# EAGLE design Qwiic_TCA9534 (EAGLE 7.7.0)
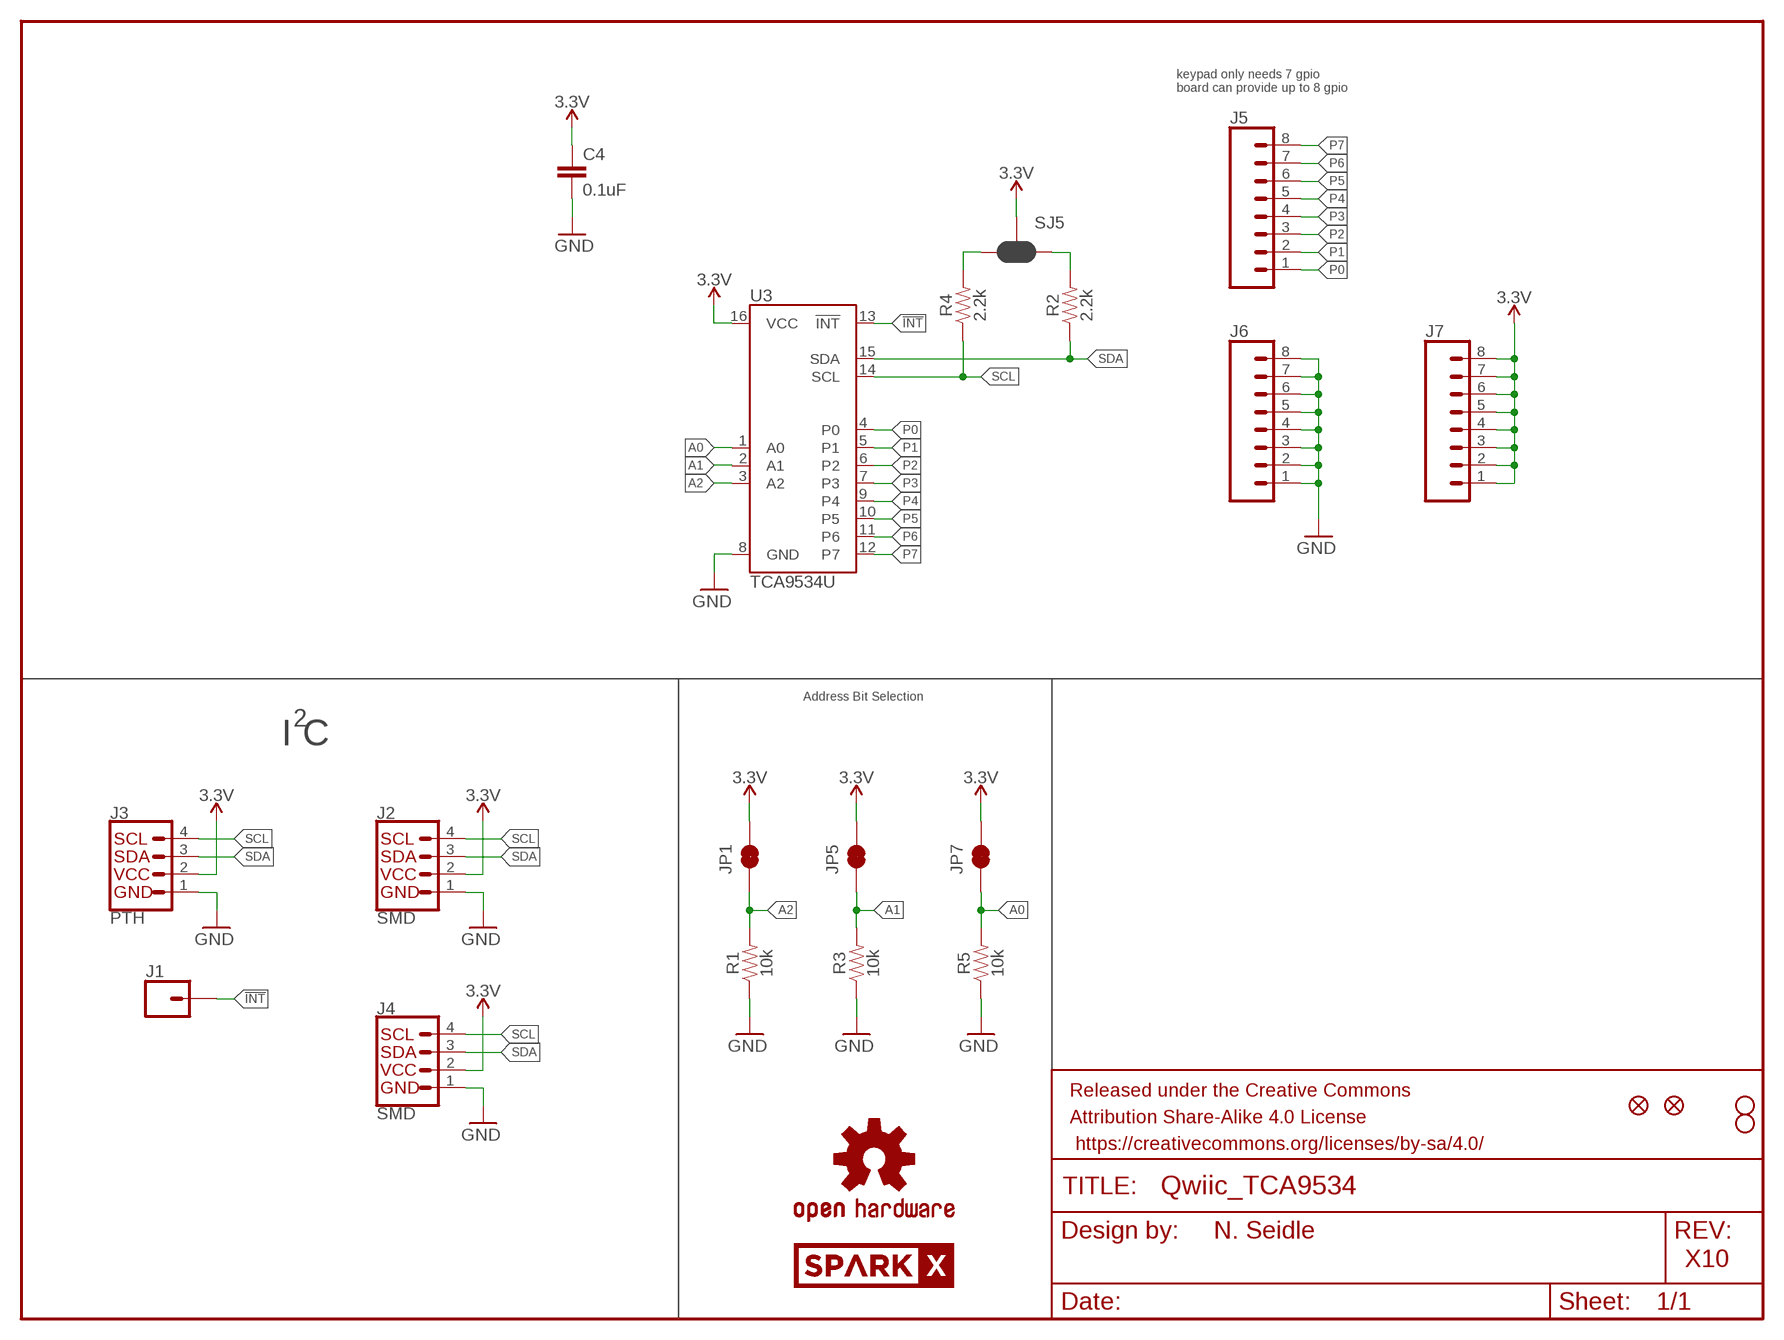
[diagram p0: schematic, sheet 1]

## Parts
C4  0.1uF  0.1UF-0603-25V-(+80/-20%)  [0603]
FRAME1  FRAME-LETTER  [CREATIVE_COMMONS]
J1  CONN_01PTH_NO_SILK_YES_STOP  [1X01_NO_SILK]
J2  SMD  I2C_STANDARDJS-1MM  [1X04_1MM_RA]
J3  PTH  I2C_STANDARD_NO_SILK  [1X04_NO_SILK]
J4  SMD  I2C_STANDARDJS-1MM  [1X04_1MM_RA]
J5  CONN_08NO_SILK_FEMALE_PTH  [1X08_NO_SILK]
J6  CONN_08NO_SILK_FEMALE_PTH  [1X08_NO_SILK]
J7  CONN_08NO_SILK_FEMALE_PTH  [1X08_NO_SILK]
JP1  JUMPER-SMT_2_NC_TRACE_NO-SILK  [SMT-JUMPER_2_NC_TRACE_NO-SILK]
JP2  FIDUCIALUFIDUCIAL  [MICRO-FIDUCIAL]
JP3  STAND-OFF  [STAND-OFF]
JP4  STAND-OFF  [STAND-OFF]
JP5  JUMPER-SMT_2_NC_TRACE_NO-SILK  [SMT-JUMPER_2_NC_TRACE_NO-SILK]
JP6  FIDUCIALUFIDUCIAL  [MICRO-FIDUCIAL]
JP7  JUMPER-SMT_2_NC_TRACE_NO-SILK  [SMT-JUMPER_2_NC_TRACE_NO-SILK]
LOGO1  OSHW-LOGOMINI  [OSHW-LOGO-MINI]
R1  10k  2.2KOHM-0603-1/10W-1%  [0603]
R2  2.2k  2.2KOHM-0603-1/10W-1%  [0603]
R3  10k  2.2KOHM-0603-1/10W-1%  [0603]
R4  2.2k  2.2KOHM-0603-1/10W-1%  [0603]
R5  10k  2.2KOHM-0603-1/10W-1%  [0603]
SJ5  SMT-JUMPER-_3-2-NC-PASTE_TALL  [SMT-JUMPER_3-2-NC-PASTE_SILK_TALLER_A]
U3  TCA9534U  [16SOIC]
U$1  SPARKX-LOGO3  [SPARKX-SMALL]
U$2  SPARKX-LOGO3  [SPARKX-SMALL]

## Nets
3.3V: C4.1 J2.2(VCC) J3.2(VCC) J4.2(VCC) J7.1 J7.2 J7.3 J7.4 J7.5 J7.6 J7.7 J7.8 JP1.2 JP5.2 JP7.2 SJ5.2 U3.16(VCC)
!INT: J1.1 U3.13(!INT)
A0: JP7.1 R5.2 U3.1(A0)
A1: JP5.1 R3.2 U3.2(A1)
A2: JP1.1 R1.2 U3.3(A2)
GND: C4.2 J2.1(GND) J3.1(GND) J4.1(GND) J6.1 J6.2 J6.3 J6.4 J6.5 J6.6 J6.7 J6.8 R1.1 R3.1 R5.1 U3.8(GND)
P0: J5.1 U3.4(P0)
P1: J5.2 U3.5(P1)
P2: J5.3 U3.6(P2)
P3: J5.4 U3.7(P3)
P4: J5.5 U3.9(P4)
P5: J5.6 U3.10(P5)
P6: J5.7 U3.11(P6)
P7: J5.8 U3.12(P7)
SCL: J2.4(SCL) J3.4(SCL) J4.4(SCL) R4.1 U3.14(SCL)
SCL_PU1: R2.2 SJ5.1
SDA: J2.3(SDA) J3.3(SDA) J4.3(SDA) R2.1 U3.15(SDA)
SDA_PU1: R4.2 SJ5.3

## Notes on the sheet
- keypad only needs 7 gpio
  board can provide up to 8 gpio
- 2 | Address Bit Selection
- I C
- N. Seidle
- X10

## Library data of the parts
C4 = SparkFun-Capacitors:0.1UF: 0.1µF ceramic capacitors A capacitor is a passive two-terminal electrical component used to store electrical energy temporarily in an electric field.; PROD_ID: CAP-00810
FRAME1 = SparkFun-Aesthetics:FRAME-LETTER: Schematic Frame - Letter Standard 8.5x11 US Letter frame
J1 = SparkFun-Connectors:CONN_01: Single connection point. Often used as Generic Header-pin footprint for 0.1 inch spaced/style header connections On any of the 0.1 inch spaced packages, you can populate with these: Break Away Headers - Straight <https://www.sparkfun.com/products/116> (PRT-00116) Break Away Male Headers - Right Angle <https://www.sparkfun.com/products/553> (PRT-00553) Female Headers <https://www.sparkfun.com/products/115> (PRT-00115) Break Away Headers - Machine Pin <https://www.sparkfun.com/products/117> (PRT-00117) Break Away Female Headers - Swiss Machine Pin <https://www.sparkfun.com/products/743> (PRT-00743) This device is also useful as a general connection point to wire up your design to another part of your project. Our various solder wires solder well into these plated through hole pads. Hook-Up Wire - Assortment (Stranded, 22 AWG) <https://www.sparkfun.com/products/11375> (PRT-11375) Hook-Up Wire - Assortment (Solid Core, 22 AWG) <https://www.sparkfun.com/products/11367> (PRT-11367) View the entire wire category on our website here <https://www.sparkfun.com/categories/141> Special notes: SMTSO-256-ET is a "flush mount" nut for a 4-40 screw. We mostly use this on specialty testbeds; it is a nice way to connect hardware to your PCB at an adjustable hieght. Also note, the SNAP packages are for using a snappable style connector. We sell a baggie of snaps and they are also used on two LilyPad designs: Snap Assortment - 30 pack (male and female) <https://www.sparkfun.com/products/11347> (DEV-11347) LilyPad Arduino SimpleSnap <https://www.sparkfun.com/products/10941> (DEV-10941) LilyPad SimpleSnap Protoboard <https://www.sparkfun.com/products/10940> (DEV-10940)
J2-J4 = SparkX:I2C_STANDARD: SparkFun I2C Standard Pinout Header SparkFun has standardized on a pinout for all I2C based sensor breakouts. This pinout allows I2C boards to be plugged directly into the headers on Arduino Uno compatible boards, and to be daisy chained easily. Example SparkFun Products: SparkFun Atmospheric Sensor Breakout - BME280 <https://www.sparkfun.com/products/13676> SparkFun Altitude/Pressure Sensor Breakout - MPL3115A2 <https://www.sparkfun.com/products/11084> SparkFun TOF Range Finder Sensor - VL6180 <https://www.sparkfun.com/products/12785>
J5-J7 = SparkFun-Connectors:CONN_08: Multi connection point. Often used as Generic Header-pin footprint for 0.1 inch spaced/style header connections On any of the 0.1 inch spaced packages, you can populate with these: Break Away Headers - Straight <https://www.sparkfun.com/products/116> (PRT-00116) Break Away Male Headers - Right Angle <https://www.sparkfun.com/products/553> (PRT-00553) Female Headers <https://www.sparkfun.com/products/115> (PRT-00115) Break Away Headers - Machine Pin <https://www.sparkfun.com/products/117> (PRT-00117) Break Away Female Headers - Swiss Machine Pin <https://www.sparkfun.com/products/743> (PRT-00743) Arduino Stackable Header - 8 Pin <https://www.sparkfun.com/products/9279> (PRT-09279) For SCREWTERMINALS and SPRING TERMINALS visit here: Screw Terimnals on SparkFun.com <https://www.sparkfun.com/search/results?term=Screw+Terminals> (5mm/3.5mm/2.54mm spacing) This device is also useful as a general connection point to wire up your design to another part of your project. Our various solder wires solder well into these plated through hole pads. Hook-Up Wire - Assortment (Stranded, 22 AWG) <https://www.sparkfun.com/products/11375> (PRT-11375) Hook-Up Wire - Assortment (Solid Core, 22 AWG) <https://www.sparkfun.com/products/11367> (PRT-11367) View the entire wire category on our website here <https://www.sparkfun.com/categories/141> Special notes: Molex polarized connector foot print use with SKU : PRT-08231 with associated crimp pins and housings. 1MM SMD Version SKU: PRT-10208 NOTES ON THE VARIANTS LOCK and LOCK_LONGPADS... This footprint was designed to help hold the alignment of a through-hole component (i.e. 6-pin header) while soldering it into place. You may notice that each hole has been shifted either up or down by 0.005 of an inch from it's more standard position (which is a perfectly straight line). This slight alteration caused the pins (the squares in the middle) to touch the edges of the holes. Because they are alternating, it causes a "brace" to hold the component in place. 0.005 has proven to be the perfect amount of "off-center" position when using our standard breakaway headers. Although looks a little odd when you look at the bare footprint, once you have a header in there, the alteration is very hard to notice. Also,if you push a header all the way into place, it is covered up entirely on the bottom side.; PROD_ID: CONN-08438
JP1 JP5 JP7 = SparkFun-Jumpers:JUMPER-SMT_2_NC_TRACE: Normally closed trace jumper This jumper has a trace between two pads so it's normally closed (NC). Use a razor knife to open the connection. For best results follow the IPC guidelines for cutting traces: Cutout at least 0.063 mm (0.005 in). Remove all loose material to clean up the cut area. Seal the cut with an approved epoxy. Reapply solder to reclose the connection.
JP2 JP6 = SparkFun:FIDUCIAL: Fiducial Alignment Points Various fiducial points for machine vision alignment.
JP3 JP4 = SparkFun:STAND-OFF: Stand Off This is the mechanical footprint for a #4 phillips button head screw. Use the keepout ring to avoid running the screw head into surrounding components. SKU : PRT-00447
LOGO1 = SparkFun-Aesthetics:OSHW-LOGO: Open-Source Hardware (OSHW) Logo This logo indicates the piece of hardware it is found on incorporates a OSHW license and/or adheres to the definition of open source hardware found here: http://freedomdefined.org/OSHW
R1 R3 R5 = SparkFun-Resistors:2.2KOHM: 2.2kΩ resistor A resistor is a passive two-terminal electrical component that implements electrical resistance as a circuit element. Resistors act to reduce current flow, and, at the same time, act to lower voltage levels within circuits. - Wikipedia; PROD_ID: RES-08272; VALUE: 2.2k
R2 R4 = SparkFun-Resistors:2.2KOHM: 2.2kΩ resistor A resistor is a passive two-terminal electrical component that implements electrical resistance as a circuit element. Resistors act to reduce current flow, and, at the same time, act to lower voltage levels within circuits. - Wikipedia; PROD_ID: RES-08272
SJ5 = KevinKuwata_eagle:SMT-JUMPER-_3-2-NC-PASTE
U3 = KevinKuwata_eagle:TCA9534
U$1 U$2 = SparkX:SPARKX-LOGO

## Board
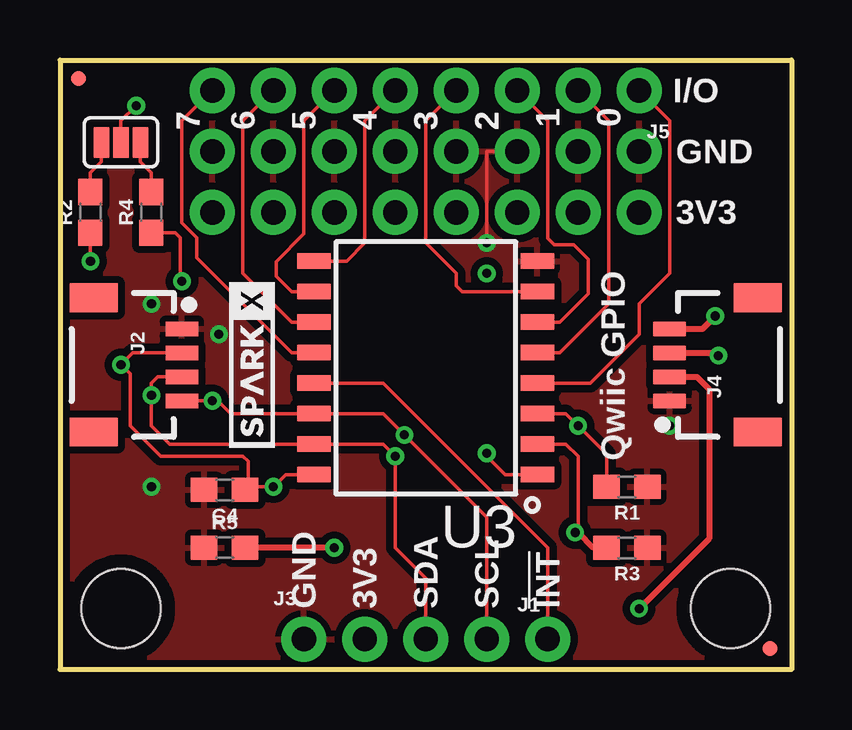
[diagram p1: board, top side]
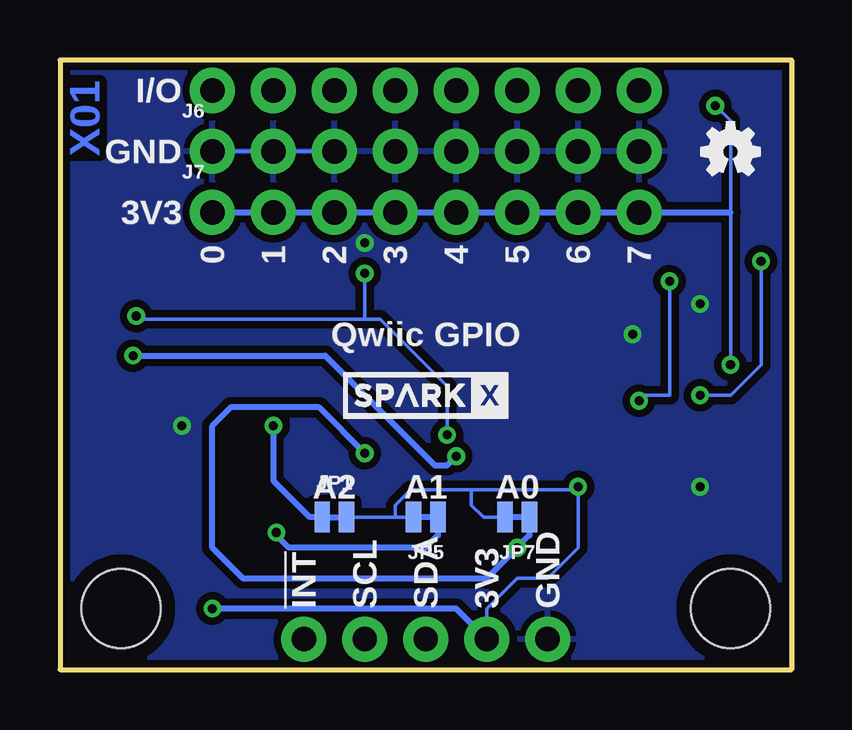
[diagram p2: board, bottom side, seen from below]

Size 30.48 x 25.4 mm. Coordinates in mm from the lower left corner, seen from the top.
Outline: 0,25.4 30.48,25.4 30.48,0 0,0 0,25.4
Copper layers (1*16): Top 0.035mm / dielectric 1.5mm / Bottom 0.035mm
Design rules "SparkFun-2-layer-PCBWay-LIMIT": minimum track width 6mil, minimum drill 12mil, track to track 6mil, track to pad 6mil, pad to pad 6mil, via to via 6mil, smd to smd 6mil, copper to edge 6mil, drill to drill 6mil, minimum pad ring 7mil, minimum via ring 7mil, stop-mask expansion 4mil, vias tented up to drill 25mil, thermal gap 10mil

### Footprints (pad centres in the part's own frame; a part is rotated, then mirrored left to right if it is on the bottom)
0603 = smd 1.1 x 1: 1 -0.85,0; 2 0.85,0
1X01_NO_SILK = drill 1.016 pad 1.88: 1 0,0
1X04_1MM_RA = smd 0.6 x 1.35: 1 -1.5,0; 2 -0.5,0; 3 0.5,0; 4 1.5,0 | smd 1.2 x 2: NC1 2.8,-3.675; NC2 -2.8,-3.675
1X04_NO_SILK = drill 1.016 pad 1.88: 1 0,0; 2 2.54,0; 3 5.08,0; 4 7.62,0
1X08_NO_SILK = drill 1.016 pad 1.88: 1 0,0; 2 2.54,0; 3 5.08,0; 4 7.62,0; 5 10.16,0; 6 12.7,0; 7 15.24,0; 8 17.78,0
SMT-JUMPER_2_NC_TRACE_NO-SILK = smd 0.635 x 1.27: 1 -0.508,0; 2 0.508,0
MICRO-FIDUCIAL = smd 0.635 x 0.635: 1 0,0
STAND-OFF = hole 3.302: 0,0
SMT-JUMPER_3-2-NC-PASTE_SILK_TALLER_A = smd 0.635 x 1.27: 1 -0.813,0; 2 0,0; 3 0.813,0
16SOIC = smd 1.397 x 0.648: 1 -4.65,4.445; 2 -4.65,3.175; 3 -4.65,1.905; 4 -4.65,0.635; 5 -4.65,-0.635; 6 -4.65,-1.905; 7 -4.65,-3.175; 8 -4.65,-4.445; 9 4.65,-4.445; 10 4.65,-3.175; 11 4.65,-1.905; 12 4.65,-0.635; 13 4.65,0.635; 14 4.65,1.905; 15 4.65,3.175; 16 4.65,4.445

### Placement (x,y rotation side)
C4  6.86,7.49 180 top
FRAME1  -16.51,-49.53 0 top  (outside the outline)
J1  20.32,1.27 0 top
J2  5.08,12.7 270 top
J3  10.16,1.27 0 top
J4  25.4,12.7 90 top
J5  24.13,24.13 180 top
J6  24.13,21.59 0 bottom
J7  24.13,19.05 0 bottom
JP1  19.05,6.35 0 bottom
JP2  29.59,0.89 0 top
JP3  2.54,2.54 0 top
JP4  27.94,2.54 0 top
JP5  15.24,6.35 180 bottom
JP6  0.76,24.64 0 top
JP7  11.43,6.35 180 bottom
LOGO1  2.54,21.59 0 bottom
R1  23.62,7.62 180 top
R2  1.27,19.05 90 top
R3  23.62,5.08 180 top
R4  3.81,19.05 90 top
R5  6.86,5.08 0 top
SJ5  2.54,21.97 0 top
U3  15.24,12.57 180 top
U$1  15.24,11.43 0 bottom
U$2  8,12.7 90 top

### Tracks (layer width: path | path; a pad name or v marks a point on that pad's centre or on a via)
3.3V  (via drill 0.38)
  Top 0.152: SJ5.2 2.54,22.86 v3.17,23.5 | J2.2 3.04,13.2 v2.54,12.7 2.92,12.32 2.92,10.16 4.19,8.89 7.62,8.89 7.83,8.68 7.83,7.62 | 7.83,7.62 v8.89,7.62 9.4,8.13 U3.16 | 7.83,7.62 C4.1
  Top 0.254: J4.2 26.54,12.2 27.05,11.68 27.05,5.46 v24.13,2.54
  Bottom 0.152: v3.17,23.5 2.54,22.86 2.54,19.05 v2.54,12.7 | 11.43,6.35 JP7.2 12.83,6.35 13.34,6.86 13.34,7.49 | 16.51,6.35 JP5.2 | 16.51,6.35 16.51,6.86 15.88,7.49 13.34,7.49 | 16.51,6.35 JP1.2 | J3.2 12.7,2.54 11.43,3.81 10.16,3.81 8.89,5.08 v8.89,7.62 9.02,7.49 13.34,7.49
  Bottom 0.254: J3.2 13.97,2.54 v24.13,2.54 | J7.1 J7.2 J7.3 J7.4 J7.5 J7.6 J7.7 J7.8 2.54,19.05
!INT
  Top 0.152: U3.13 13.46,11.94 20.32,5.08 J1.1
A0  (via drill 0.38)
  Top 0.152: U3.1 18.54,8.13 17.78,8.89 v17.78,9.02
  Top 0.254: v11.43,5.08 R5.2
  Bottom 0.254: v17.78,9.02 19.68,10.92 23.37,10.92 24.13,10.16 24.13,5.08 22.86,3.81 12.7,3.81 v11.43,5.08 10.92,5.59 JP7.1
A1  (via drill 0.38)
  Top 0.152: U3.2 21.08,9.4 21.59,8.89 21.59,5.84 v21.46,5.71
  Top 0.254: R3.2 22.23,5.08 21.59,5.71 v21.46,5.71
  Bottom 0.254: v21.46,5.71 21.46,5.59 20.95,5.08 15.24,5.08 14.73,5.59 JP5.1
A2  (via drill 0.38)
  Top 0.152: U3.3 21.08,10.67 v21.59,10.16 22.77,8.98 R1.2
  Bottom 0.254: JP1.1 20.07,6.35 21.59,7.87 v21.59,10.16
GND  (via drill 0.38)
  Top 0.152: J6.3 17.78,21.59 v17.78,17.78
  Bottom 0.152: J6.3 J6.1
  other vias: 3.81,7.62 3.81,15.24 25.4,10.16 6.62,13.97
  pour Bottom (isolate 0.305): 0,0 0,25.4 30.48,25.4 30.48,0
  pour Top (isolate 0.305): 0,0 0,25.4 30.48,25.4 30.48,0
P0
  Top 0.152: J5.1 25.4,22.86 25.4,16.51 24.13,15.24 24.13,13.97 22.1,11.94 U3.4
P1
  Top 0.152: J5.2 22.86,22.86 22.86,15.24 20.83,13.21 U3.5
P2
  Top 0.152: J5.3 20.32,22.86 20.32,17.98 20.6,17.7 21.4,17.7 22,17.1 22,15.65 20.83,14.48 U3.6
P3
  Top 0.152: U3.7 16.76,15.75 16.51,16 16.51,16.51 15.24,17.78 15.24,22.86 J5.4
P4
  Top 0.152: J5.5 12.7,22.86 12.7,17.78 11.94,17.02 U3.9
P5
  Top 0.152: J5.6 10.16,22.86 10.16,18.16 9,17 9,16.4 9.65,15.75 U3.10
P6
  Top 0.152: J5.7 7.62,22.86 7.62,16.51 9.65,14.48 U3.11
P7
  Top 0.152: J5.8 5.08,22.86 5.08,18.62 5.7,18 5.7,17.16 9.65,13.21 U3.12
SCL  (via drill 0.38)
  Top 0.152: R4.1 4.8,18.2 5,18 5,16.26 v5.08,16.18 | J2.4 v6.35,11.2 6.58,11.2 7.11,10.67 U3.14 13.46,10.67 v14.35,9.78 17.78,6.35 J3.4
  Top 0.254: J4.4 26.77,14.2 v27.3,14.73
  Bottom 0.152: v5.08,16.18 5.08,11.43 6.12,11.43 v6.35,11.2 | 17.78,14.61 17.14,14.61 14.35,11.81 v14.35,9.78 | 17.78,14.61 27.18,14.61 v27.3,14.73 | v17.78,16.51 17.78,14.61
SCL_PU1
  Top 0.152: SJ5.1 1.73,21.16 1.27,20.7 R2.2
SDA  (via drill 0.38)
  Top 0.152: J2.3 4.07,12.2 3.81,11.94 v3.81,11.43 3.81,10.16 4.57,9.4 U3.15 13.46,9.4 v13.97,8.89 13.97,5.08 15.24,3.81 J3.3 | R2.1 v1.27,17.02
  Top 0.254: J4.3 27.31,13.2 v27.43,13.08
  Bottom 0.152: v1.27,17.02 1.27,12.7 2.54,11.43 v3.81,11.43
  Bottom 0.254: v27.43,13.08 19.43,13.08 14.86,8.51 14.35,8.51 v13.97,8.89
SDA_PU1
  Top 0.152: SJ5.3 3.35,21.16 3.81,20.7 R4.2

### Text on the board
Bottom: X01
tPlace: I/O | 1 | 0 | 7 | 6 | 5 | 4 | 3 | 2 | GND | 3V3 | Qwiic GPIO | GND | 3V3 | SDA | SCL | !INT
bPlace: I/O | GND | 3V3 | 7 | 6 | 5 | 4 | 3 | 2 | 1 | 0 | Qwiic GPIO | A0 | A1 | A2 | GND | 3V3 | SDA | SCL | !INT
tDocu: Kevin Kuwata